# Altium schematic sheet PowerPCB2.SchDoc
size A
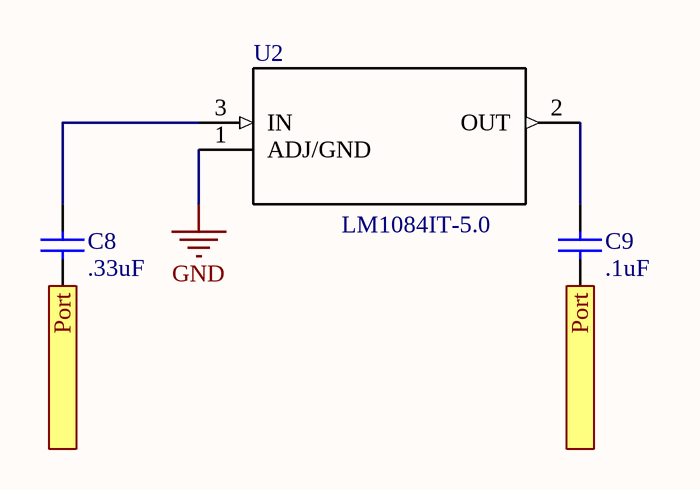
[diagram p0: PowerPCB2.SchDoc]

## Parts
C8  .33uF  [CAPC2013X100X45ML10T25]
C9  .1uF  [CAPC2013X135X45ML10T25]
U2  LM1084IT-5.0  [*TO254P470X1016X2222-3P]

## Ports
Port (in), Port (out)

## Nets
GND: U2.1(ADJ/GND)
Port: C8.1 C9.1 ; port Port
NetC8_2: C8.2 U2.3(IN)
NetC9_2: C9.2 U2.2(OUT)

## Library data of the parts
C8 = CMP-2007-03926-1: Part Number: GRM21AR72A334KAC5L; Manufacturer: Murata
C9 = CMP-2100-03644-1: Chip Capacitor, 0.1 uF, +/- 10%, 50 V, -55 to 125 degC, 0805 (2012 Metric), RoHS, Tape and Reel; Manufacturer: Murata; Voltage: 50V; Capacitance: 100nF; Insulation Resistance: 10GR; Dielectric Material: Ceramic; Dielectric: X7R; Package Description: 2-Pin Surface Mount Device, Body 2 x 1.25 mm; Manufacturer URL: http://www.murata.com/; Case Code (Imperial): 0805; Datasheet URL: http://psearch.en.murata.com/capacitor/product/GRM21BR71H104KA01%23.pdf; Termination: SMD/SMT; Lead Free: LeadFree; Package Quantity: 1; Mount: SurfaceMount; REACH SVHC: Unknown; Thickness: 0.053inch; Height: 1.25mm; Case/Package: 0805; Voltage Rating: 50V; Width: 0.049inch; Case Code (Metric): 2012; Material: Ceramic; Min Operating Temperature: -55degC; RoHSCompliant: true; Datasheet Version: 42675.0; Voltage Rating (DC): 50V; Tolerance: 10%; Package Reference: 0805; Depth: 1.25mm; Length: 2mm; Max Operating Temperature: 125degC; Packaging: TapeandReel; Number of Pins: 2; Radiation Hardening: No
U2 = LM1084IT-5.0: Voltage stabiliser; LDO, fixed; 5V; 5A; TO220; THT; 1.2; MF: Texas Instruments; MP: LM1084IT-5.0/NOPB; SnapEDA_Link: https://www.snapeda.com/parts/LM1084IT-5.0/NOPB/Texas%20Instruments/view-part/?ref=snap; Availability: Unavailable; Price: None; Package: TO-220 Texas Instruments; Value: *